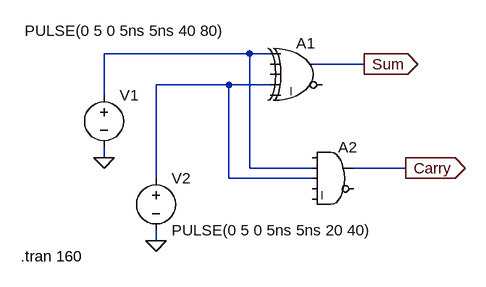
[diagram p0: schematic Half-Adder.asc]
Half-Adder.asc, the LTspice schematic file:
Version 4
SHEET 1 880 680
WIRE 288 -80 64 -80
WIRE 320 -80 288 -80
WIRE 464 -64 384 -64
WIRE 256 -32 144 -32
WIRE 320 -32 256 -32
WIRE 64 -16 64 -80
WIRE 64 80 64 64
WIRE 288 96 288 -80
WIRE 384 96 288 96
WIRE 528 96 448 96
WIRE 144 112 144 -32
WIRE 256 112 256 -32
WIRE 384 112 256 112
WIRE 144 208 144 192
FLAG 64 80 0
FLAG 144 208 0
FLAG 464 -64 Sum
IOPIN 464 -64 Out
FLAG 528 96 Carry
IOPIN 528 96 Out
SYMBOL voltage 64 -32 R0
WINDOW 3 -122 -83 Left 2
WINDOW 123 0 0 Left 0
WINDOW 39 0 0 Left 0
SYMATTR Value PULSE(0 5 0 5ns 5ns 40 80)
SYMATTR InstName V1
SYMBOL voltage 144 96 R0
WINDOW 123 0 0 Left 0
WINDOW 39 0 0 Left 0
SYMATTR InstName V2
SYMATTR Value PULSE(0 5 0 5ns 5ns 20 40)
SYMBOL Digital\\xor 368 -112 R0
SYMATTR InstName A1
SYMBOL Digital\\and 416 48 R0
SYMATTR InstName A2
TEXT -64 232 Left 2 !.tran 160

The netlist it stands for:
* Half-Adder.asc
V1 N001 0 PULSE(0 5 0 5ns 5ns 40 80)
V2 N002 0 PULSE(0 5 0 5ns 5ns 20 40)
A1 N001 0 0 N002 0 0 Sum 0 XOR
A2 0 N001 N002 0 0 0 Carry 0 AND
.tran 160
.backanno
.end

* Results of the author's LTspice run, read from the files saved beside the schematic
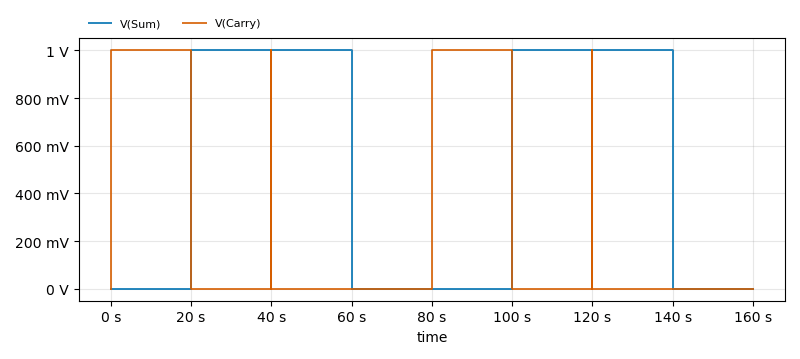
[diagram p1: Transient Analysis of Half-Adder.asc, plotted from the saved traces]
* Transient Analysis, 1 run:
*   V(Sum): min 0 V, max 1 V, average 500 mV, rms 707.1 mV, last 0 V
*   V(Carry): min 0 V, max 1 V, average 250 mV, rms 500 mV, last 0 V